# Altium project Nabaztag_RPI_V2.0.PrjPcb
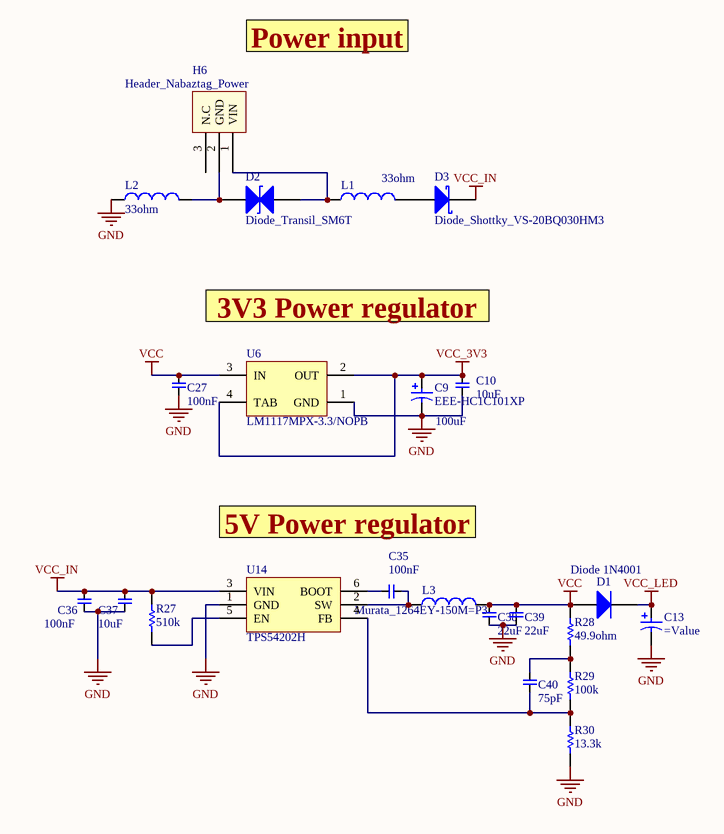
[diagram p0: PyNab_Power.SchDoc]
4 sheets, 151 parts. Net scope: flat (ports and power ports of the same name join across sheets).
Board file: Nabaztag_RPI_V2.0.PcbDoc
Sheets:
  PyNab_Power.SchDoc
  PyNab_Header_LED_RFID.SchDoc
  PyNab_Audio.SchDoc
  PyNab_Motor&Encoders.SchDoc

## Sheet PyNab_Power.SchDoc: PyNab - Power
size A4; CompanyName: Enero; DrawnBy: Enero; Engineer: Hugo Balette-pape; Organization: ENERO; Address1: 7, rue ambroise thomas; Address2: 75009; Address3: Paris; Address4: France; Revision: 2.0; SheetNumber: 1; SheetTotal: 4

### Parts
C9  EEE-HC1C101XP  value 100uF  [EEE-HC1C101XP]
C10  10uF  [CAP0603]
C13  (no value)  [CAPAE6083X105M]
C27  100nF  [CAP0603]
C35  100nF  [CAP0603]
C36  100nF  [CAP0603]
C37  10uF  [CAP0603]
C38  22uF  [CAP0603]
C39  22uF  [CAP0603]
C40  75pF  [CAP0603]
D1  Diode 1N4001  [DO-41]
D2  Diode_Transil_SM6T  [Diode_Transil_SM6T]
D3  Diode_Shottky_VS-20BQ030HM3  [Diode_Shottky_VS-20BQ030HM3]
H6  Header_Nabaztag_Power  [HDR3x1_Nabaztag_pwr]
L1  33ohm  [IND0603]
L2  33ohm  [IND0603]
L3  Murata_1264EY-150M=P3  [Murata-1264EY-150M=P3]
R27  510k  [RES0603]
R28  49.9ohm  [RES0603]
R29  100k  [RES0603]
R30  13.3k  [RES0603]
U6  LM1117MPX-3.3/NOPB  [MP04A_N]
U14  TPS54202H  [SOT95P280X110-6N]

### Nets
GND: C9.1(K) C10.1 C13.2(K) C27.1 C36.1 C37.1 C38.1 C39.1 L2.2 R30.1 U6.1(GND) U14.1(GND)
VCC: C27.2 C38.2 C39.2 D1.1(A) L3.2 R28.2 U6.3(IN)
VCC_3V3: C9.2(A) C10.2 U6.2(OUT) U6.4(TAB)
VCC_IN: C36.2 C37.2 D3.1(K) R27.1 U14.3(VIN)
VCC_LED: C13.1(A) D1.2(K)
NetC35_1: C35.1 L3.1 U14.2(SW)
NetC35_2: C35.2 U14.6(BOOT)
NetC40_1: C40.1 R28.1 R29.2
NetC40_2: C40.2 R29.1 R30.2 U14.4(FB)
NetD2_1: D2.1 H6.2(GND) L2.1
NetD2_2: D2.2 H6.1(VIN) L1.2
NetD3_2: D3.2(A) L1.1
NetR27_2: R27.2 U14.5(EN)

Not connected (* = marked no-connect by the designer): H6 3(N.C)

### Notes on the sheet
- Power input
- 3V3 Power regulator
- 5V Power regulator
- Title
- Size:
- Date:
- A4
- Number:
- Time:
- Revision:
- Sheet
- of
- File:

### Library data of the parts
C9 = VS0608 pol cap electro SMT
C10 C27 C35-C40 = Capacitor_np: Non-polarised capacitor
  C10 C37: Value: 10uF
  C27 C35 C36: Value: 100nF
  C38 C39: Value: 22uF
  C40: Value: 75pF
C13 = Capacitor_pol: Polarised capacitor
D1 = Diode 1N4001: 1 Amp General Purpose Rectifier; Published: 8-Jun-2000; LatestRevisionDate: 17-Jul-2002; LatestRevisionNote: Re-released for DXP Platform.; DatasheetVersion: 1998; PackageVersion: Aug-1999; PackageReference: DO-41; Publisher: Altium Limited; PackageDescription: Diode, Axial; Body 5.2 x 2.7 mm (LxDia. max), Lead Dia. 0.86 mm (max); Code_JEDEC: DO-204-AL; ComponentLink1Description: Manufacturer Link; ComponentLink1URL: http://www.fairchildsemi.com/; ComponentLink2Description: Datasheet; ComponentLink2URL: http://www.fairchildsemi.com/ds/1N%2F1N4001.pdf
H6 = Header_Nabaztag_Power: Power Header
L1 L2 = Inductor1: Inductor 0603 blm18pg330sn; Value: 33ohm
L3 = Inductor1: Inductor; Value: =Value
R27-R30 = Resistor1: Resistor
  R27: Value: 510k
  R28: Value: 49.9ohm
  R29: Value: 100k
  R30: Value: 13.3k
U6 = LM1117MPX-3.3/NOPB: 800mA Low-Dropout Linear Regulator, 4-pin SOT-223, Pb-Free; Manufacturer: National Semiconductor; PackageTopMarking: XYTT*N05A; PowerWise: N; CompType: LDO IC; High-Reliability: Y; DatasheetVersion: Apr-2006; PackageVersion: revB, Apr-2003; PackageReference: MP04A; PackageDescription: Molded SOT-223, 6.50 x 3.56 x 1.6mm Body, 4 Lead, 2.3mm Pitch; PartNumber: LM1117MPX-3.3/NOPB; RoHS: Y; PinCount: 4; Code_JEDEC: TO-261-AA; Code_IPC: SOT223-4; ComponentLink1Description: Manufacturer URL; ComponentLink1URL: http://www.national.com/; ComponentLink2Description: LM1117 Datasheet; ComponentLink2URL: http://www.national.com/ds/LM/LM1117.pdf; ComponentLink3Description: LM1117 Web Page; ComponentLink3URL: http://www.national.com/pf/LM/LM1117.html; ComponentLink4Description: MP04A Package Page; ComponentLink4URL: http://www.national.com/packaging/folders/mp04a.html

## Sheet PyNab_Header_LED_RFID.SchDoc: PyNab - Headers / Leds / Sensors
size A3; CompanyName: Enero; DrawnBy: Enero; Engineer: Hugo Balette-pape; Organization: ENERO; Address1: 7, rue ambroise thomas; Address2: 75009; Address3: Paris; Address4: France; Revision: 2.0; SheetNumber: 2; SheetTotal: 4
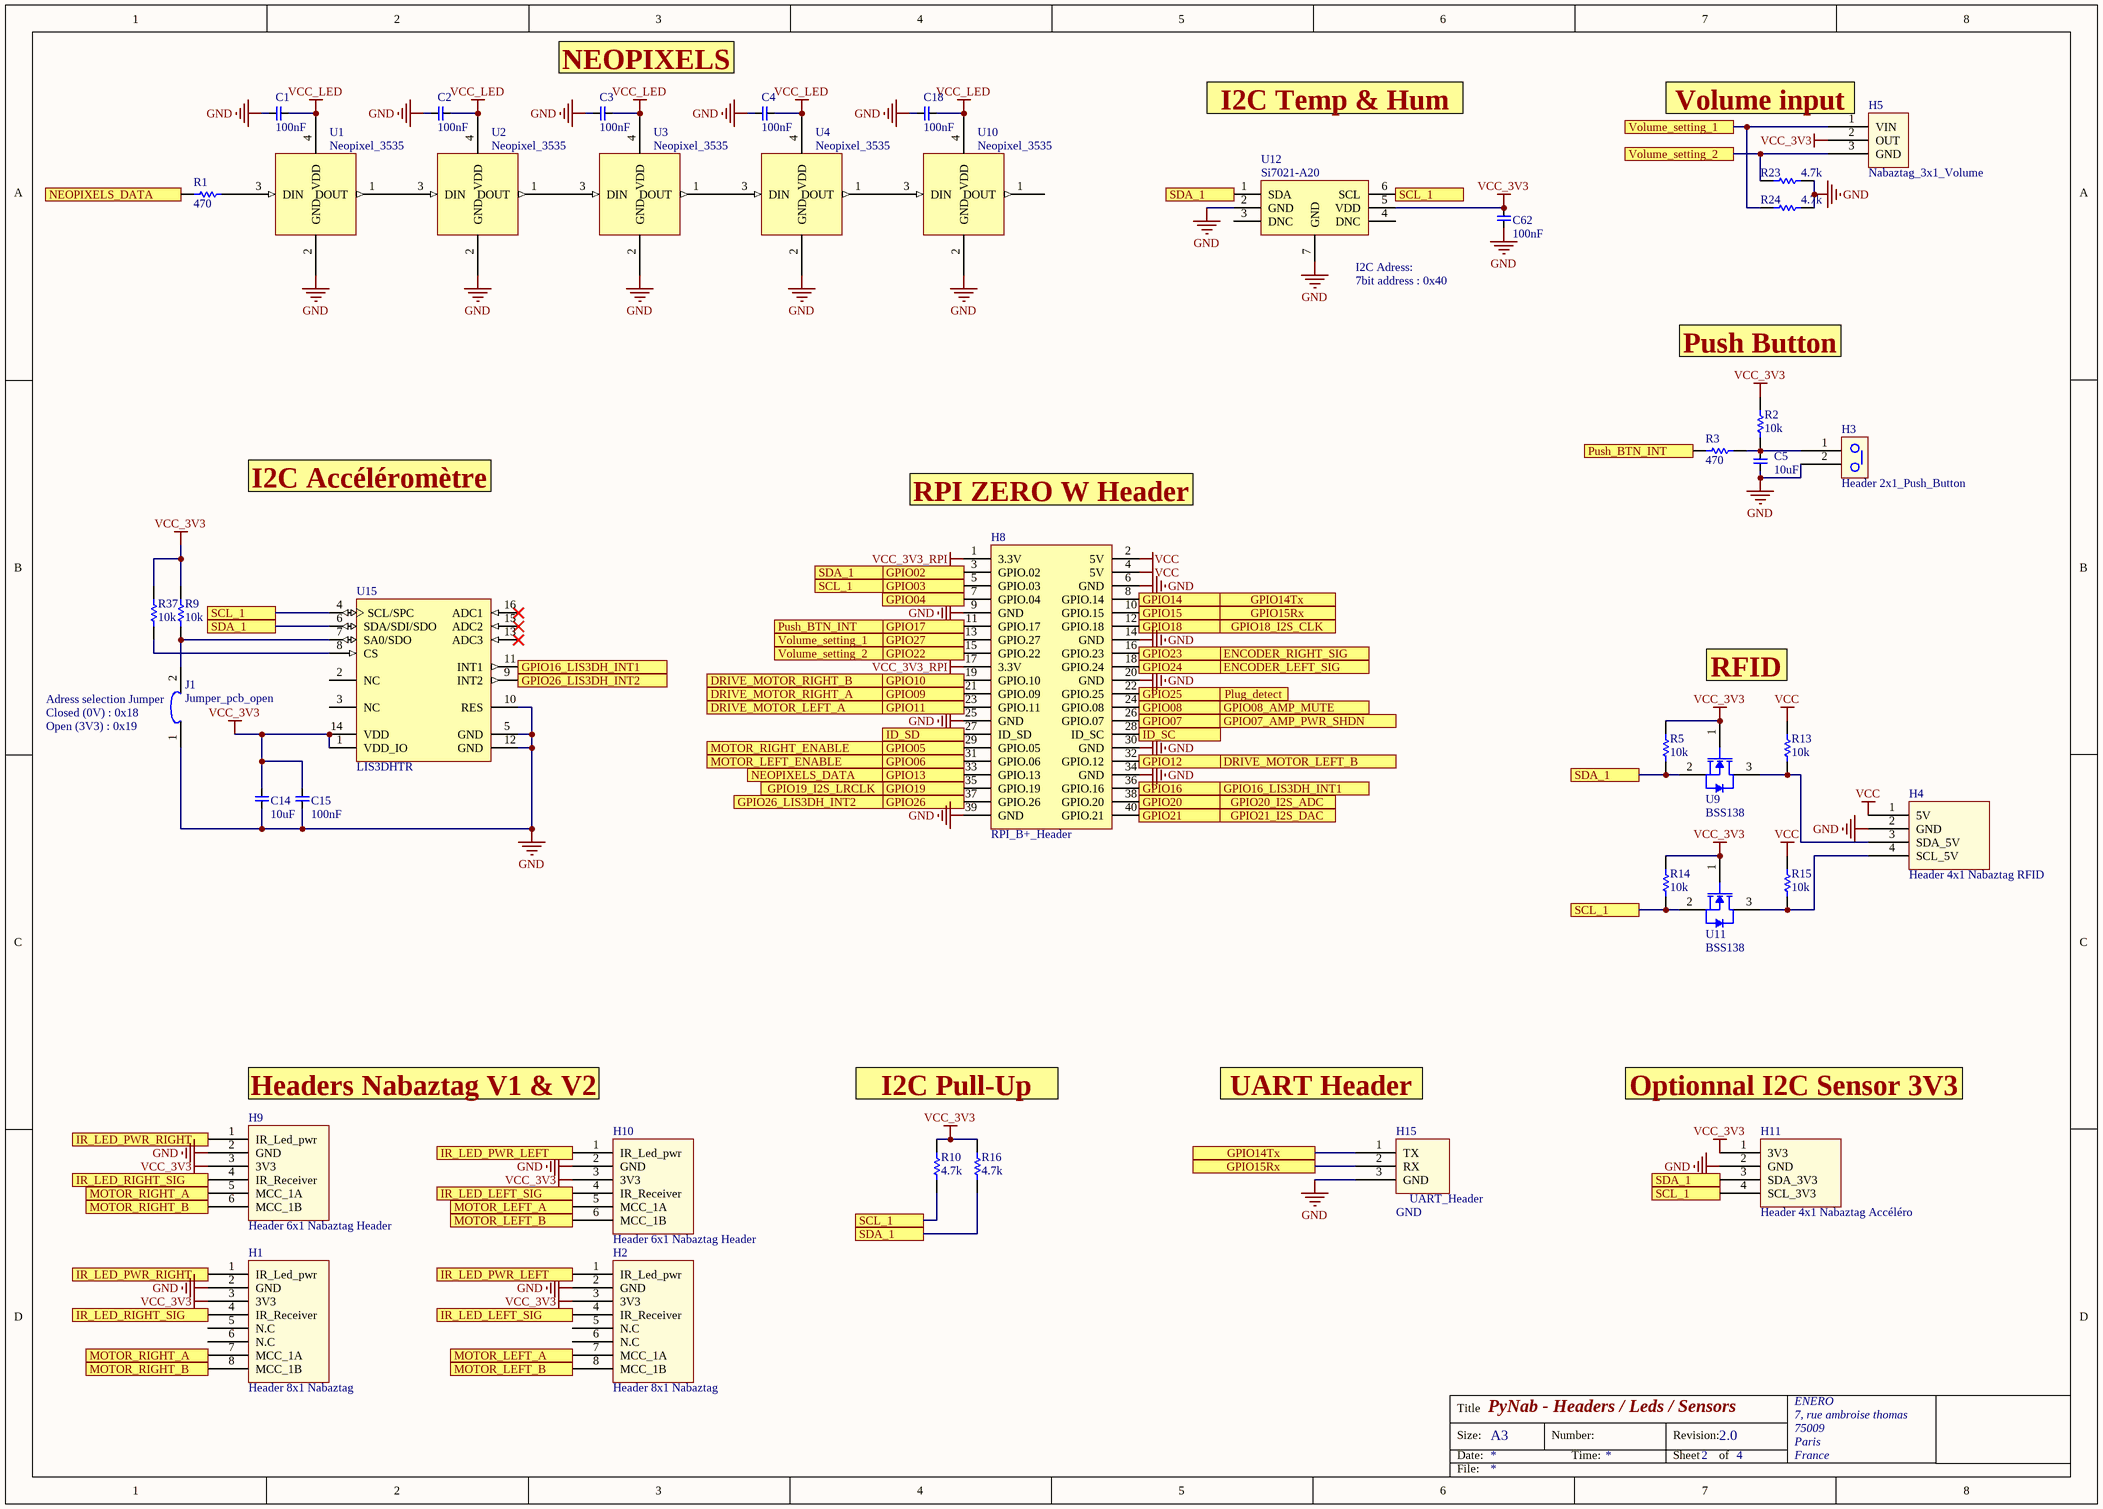
[diagram p1: PyNab_Header_LED_RFID.SchDoc]

### Parts
C1  100nF  [CAP0603]
C2  100nF  [CAP0603]
C3  100nF  [CAP0603]
C4  100nF  [CAP0603]
C5  10uF  [CAP0603]
C14  10uF  [CAP0603]
C15  100nF  [CAP0603]
C18  100nF  [CAP0603]
C62  100nF  [CAP0603]
H1  Header 8x1 Nabaztag  [HDR8x1 NABAZTAG -RIGHT]
H2  Header 8x1 Nabaztag  [HDR8x1 NABAZTAG]
H3  Header 2x1_Push_Button  [HDR2x1_Push_button]
H4  Header 4x1 Nabaztag RFID  [NABAZTAG_RFID_HEADER]
H5  Nabaztag_3x1_Volume  [Nabaztag_Volume_Header]
H8  RPI_B+_Header  [RPI_B+_40Pin_Header]
H9  Header 6x1 Nabaztag Header  [HDR6x1_Nabaztag]
H10  Header 6x1 Nabaztag Header  [HDR6x1_Nabaztag]
H11  Header 4x1 Nabaztag Accéléro  [NABAZTAG_ACCELERO_HEADER 3V3]
H15  GND  [Header_UART_3x1]
J1  Jumper_pcb_open  [Jumper_pcb open 2]
R1  470  [RES0603]
R2  10k  [RES0603]
R3  470  [RES0603]
R5  10k  [RES0603]
R9  10k  [RES0603]
R10  4.7k  [RES0603]
R13  10k  [RES0603]
R14  10k  [RES0603]
R15  10k  [RES0603]
R16  4.7k  [RES0603]
R23  4.7k  [RES0603]
R24  4.7k  [RES0603]
R37  10k  [RES0603]
U1  Neopixel_3535  [NEOPIXEL_35x35]
U2  Neopixel_3535  [NEOPIXEL_35x35]
U3  Neopixel_3535  [NEOPIXEL_35x35]
U4  Neopixel_3535  [NEOPIXEL_35x35]
U9  BSS138  [BSS138]
U10  Neopixel_3535  [NEOPIXEL_35x35]
U11  BSS138  [BSS138]
U12  Si7021-A20  [SON100P300X121_HS-7N]
U15  LIS3DHTR  [STM-LGA-16]

### Ports
DRIVE_MOTOR_LEFT_A, DRIVE_MOTOR_LEFT_B, DRIVE_MOTOR_RIGHT_A, DRIVE_MOTOR_RIGHT_B, ENCODER_LEFT_SIG, ENCODER_RIGHT_SIG, GPIO02, GPIO03, GPIO04, GPIO05, GPIO06, GPIO07, GPIO07_AMP_PWR_SHDN, GPIO08, GPIO08_AMP_MUTE, GPIO09, GPIO10, GPIO11, GPIO12, GPIO13, GPIO14, GPIO14Tx, GPIO15, GPIO15Rx, GPIO16, GPIO16_LIS3DH_INT1, GPIO17, GPIO18, GPIO18_I2S_CLK, GPIO19, GPIO19_I2S_LRCLK, GPIO20, GPIO20_I2S_ADC, GPIO21, GPIO21_I2S_DAC, GPIO22, GPIO23, GPIO24, GPIO25, GPIO26, GPIO26_LIS3DH_INT2, GPIO27, ID_SC, ID_SD, IR_LED_LEFT_SIG, IR_LED_PWR_LEFT, IR_LED_PWR_RIGHT, IR_LED_RIGHT_SIG, MOTOR_LEFT_A, MOTOR_LEFT_B, MOTOR_LEFT_ENABLE, MOTOR_RIGHT_A, MOTOR_RIGHT_B, MOTOR_RIGHT_ENABLE, NEOPIXELS_DATA, Plug_detect, Push_BTN_INT, SCL_1, SDA_1, Volume_setting_1, Volume_setting_2

### Nets
GND: C1.1 C2.1 C3.1 C4.1 C5.1 C14.2 C15.2 C18.1 C62.1 H1.2(GND) H2.2(GND) H3.2 H4.2(GND) H8.6(GND) H8.9(GND) H8.14(GND) H8.20(GND) H8.25(GND) H8.30(GND) H8.34(GND) H8.39(GND) H9.2(GND) H10.2(GND) H11.2(GND) H15.3(GND) J1.1 R23.1 R24.1 U1.2(GND) U2.2(GND) U3.2(GND) U4.2(GND) U10.2(GND) U12.2(GND) U12.7(GND) U15.5(GND) U15.10(RES) U15.12(GND)
VCC: H4.1(5V) H8.2(5V) H8.4(5V) R13.2 R15.2
VCC_3V3: C14.1 C15.1 C62.2 H1.3(3V3) H2.3(3V3) H5.2(OUT) H9.3(3V3) H10.3(3V3) H11.1(3V3) R2.2 R5.2 R9.1 R10.2 R14.2 R16.2 R37.1 U9.1(G) U11.1(G) U12.5(VDD) U15.1(VDD_IO) U15.14(VDD)
VCC_3V3_RPI: H8.1(3.3V) H8.17(3.3V)
VCC_LED: C1.2 C2.2 C3.2 C4.2 C18.2 U1.4(VDD) U2.4(VDD) U3.4(VDD) U4.4(VDD) U10.4(VDD)
NetC5_2: C5.2 H3.1 R2.1 R3.2
NetC12_2: H1.4(IR_Receiver) H9.4(IR_Receiver) ; port IR_LED_RIGHT_SIG
NetC16_2: H2.4(IR_Receiver) H10.4(IR_Receiver) ; port IR_LED_LEFT_SIG
NetC23_2: H8.22(GPIO.25) ; port GPIO25, port Plug_detect
NetH1_1: H1.1(IR_Led_pwr) H9.1(IR_Led_pwr) ; port IR_LED_PWR_RIGHT
NetH1_7: H1.7(MCC_1A) H9.5(MCC_1A) ; port MOTOR_RIGHT_A
NetH1_8: H1.8(MCC_1B) H9.6(MCC_1B) ; port MOTOR_RIGHT_B
NetH2_1: H2.1(IR_Led_pwr) H10.1(IR_Led_pwr) ; port IR_LED_PWR_LEFT
NetH2_7: H2.7(MCC_1A) H10.5(MCC_1A) ; port MOTOR_LEFT_A
NetH2_8: H2.8(MCC_1B) H10.6(MCC_1B) ; port MOTOR_LEFT_B
NetH4_3: H4.3(SDA_5V) R13.1 U9.3(D)
NetH4_4: H4.4(SCL_5V) R15.1 U11.3(D)
NetH5_1: H5.1(VIN) H8.13(GPIO.27) R24.2 ; port GPIO27, port Volume_setting_1
NetH5_3: H5.3(GND) H8.15(GPIO.22) R23.2 ; port GPIO22, port Volume_setting_2
NetH8_3: H8.3(GPIO.02) H11.3(SDA_3V3) R5.1 R16.1 U9.2(S) U12.1(SDA) U15.6(SDA/SDI/SDO) ; port GPIO02, port SDA_1
NetH8_5: H8.5(GPIO.03) H11.4(SCL_3V3) R10.1 R14.1 U11.2(S) U12.6(SCL) U15.4(SCL/SPC) ; port GPIO03, port SCL_1
NetH8_7: H8.7(GPIO.04) ; port GPIO04
NetH8_8: H8.8(GPIO.14) H15.1(TX) ; port GPIO14, port GPIO14Tx
NetH8_10: H8.10(GPIO.15) H15.2(RX) ; port GPIO15, port GPIO15Rx
NetH8_11: H8.11(GPIO.17) R3.1 ; port GPIO17, port Push_BTN_INT
NetH8_12: H8.12(GPIO.18) ; port GPIO18, port GPIO18_I2S_CLK
NetH8_16: H8.16(GPIO.23) ; port ENCODER_RIGHT_SIG, port GPIO23
NetH8_18: H8.18(GPIO.24) ; port ENCODER_LEFT_SIG, port GPIO24
NetH8_19: H8.19(GPIO.10) ; port DRIVE_MOTOR_RIGHT_B, port GPIO10
NetH8_21: H8.21(GPIO.09) ; port DRIVE_MOTOR_RIGHT_A, port GPIO09
NetH8_23: H8.23(GPIO.11) ; port DRIVE_MOTOR_LEFT_A, port GPIO11
NetH8_24: H8.24(GPIO.08) ; port GPIO08, port GPIO08_AMP_MUTE
NetH8_26: H8.26(GPIO.07) ; port GPIO07, port GPIO07_AMP_PWR_SHDN
NetH8_27: H8.27(ID_SD) ; port ID_SD
NetH8_28: H8.28(ID_SC) ; port ID_SC
NetH8_29: H8.29(GPIO.05) ; port MOTOR_RIGHT_ENABLE, port GPIO05
NetH8_31: H8.31(GPIO.06) ; port MOTOR_LEFT_ENABLE, port GPIO06
NetH8_32: H8.32(GPIO.12) ; port DRIVE_MOTOR_LEFT_B, port GPIO12
NetH8_33: H8.33(GPIO.13) R1.1 ; port NEOPIXELS_DATA, port GPIO13
NetH8_35: H8.35(GPIO.19) ; port GPIO19, port GPIO19_I2S_LRCLK
NetH8_36: H8.36(GPIO.16) U15.11(INT1) ; port GPIO16, port GPIO16_LIS3DH_INT1
NetH8_37: H8.37(GPIO.26) U15.9(INT2) ; port GPIO26, port GPIO26_LIS3DH_INT2
NetH8_38: H8.38(GPIO.20) ; port GPIO20, port GPIO20_I2S_ADC
NetH8_40: H8.40(GPIO.21) ; port GPIO21, port GPIO21_I2S_DAC
NetJ1_2: J1.2 R9.2 U15.7(SA0/SDO)
NetR1_2: R1.2 U1.3(DIN)
NetR37_2: R37.2 U15.8(CS)
NetU1_1: U1.1(DOUT) U2.3(DIN)
NetU2_1: U2.1(DOUT) U3.3(DIN)
NetU3_1: U3.1(DOUT) U4.3(DIN)
NetU4_1: U4.1(DOUT) U10.3(DIN)

Not connected (* = marked no-connect by the designer): H1 5(N.C) 6(N.C); H2 5(N.C) 6(N.C); U10 1(DOUT); U12 3(DNC) 4(DNC); U15 2(NC) 3(NC) 13(ADC3)* 15(ADC2)* 16(ADC1)*

### Notes on the sheet
- NEOPIXELS
- I2C Temp & Hum
- (near H5) Volume input
- (near U12) I2C Adress:
- 7bit address : 0x40
- Push Button
- I2C Accéléromètre
- RPI ZERO W Header
- (near J1) Adress selection Jumper
- (near J1) Closed (0V) : 0x18
- RFID
- (near J1) Open (3V3) : 0x19
- Headers Nabaztag V1 & V2
- I2C Pull-Up
- UART Header
- Optionnal I2C Sensor 3V3
- Title
- Size:
- Date:
- A3
- Number:
- Time:
- Revision:
- Sheet
- of
- File:
- (in symbol GND) UART_Header

### Library data of the parts
C1-C5 C14 C15 C18 C62 = Capacitor_np: Non-polarised capacitor
  C1-C4 C15 C18 C62: Value: 100nF
  C5 C14: Value: 10uF
H3 = Header 2x1_Push_Button: Push_Button header
H8 = RPI_B+_40Pin_Header
R1-R3 R5 R9 R10 R13-R16 R23 R24 R37 = Resistor1: Resistor
  R1 R3: Value: 470
  R2 R5 R9 R13-R15 R37: Value: 10k
  R10 R16 R23 R24: Value: 4.7k
U15 = CMP-0234-00055-4: Manufacturer: STMicroelectronics; Interface: I2C, SPI; Packing: Tape and Reel; Wide Supply Voltage: 1.71 to 3.6 V; Output Type: Digital; Bandwidth: 5 kHz; Current Consumption in Power-Down mode: 0.5 uA; ComponentLink2Description: Datasheet; ComponentLink3URL: http://www.st.com/st-web-ui/static/active/en/resource/technical/document/datasheet/CD00274221.pdf; Mounting Technology: Surface Mount; PackageReference: LGA-16; PackageDescription: 16-Pin Land Grid Array, Body 3 x 3 mm, Pitch 0.5 mm; ComponentLink3Description: Package Specification; DatasheetVersion: Rev. 1; Operating Temperature: -40 to 85 degC; PartNumber: LIS3DHTR; ComponentLink1Description: Manufacturer URL; ComponentLink1URL: http://www.st.com/; ComponentLink2URL: http://www.st.com/st-web-ui/static/active/en/resource/technical/document/datasheet/CD00274221.pdf; RoHS: TRUE

## Sheet PyNab_Audio.SchDoc: PyNab - Audio
size A4; CompanyName: Enero; DrawnBy: Enero; Engineer: Hugo Balette-pape; Organization: ENERO; Address1: 7, rue ambroise thomas; Address2: 75009; Address3: Paris; Address4: France; Revision: 2.0; SheetNumber: 3; SheetTotal: 4
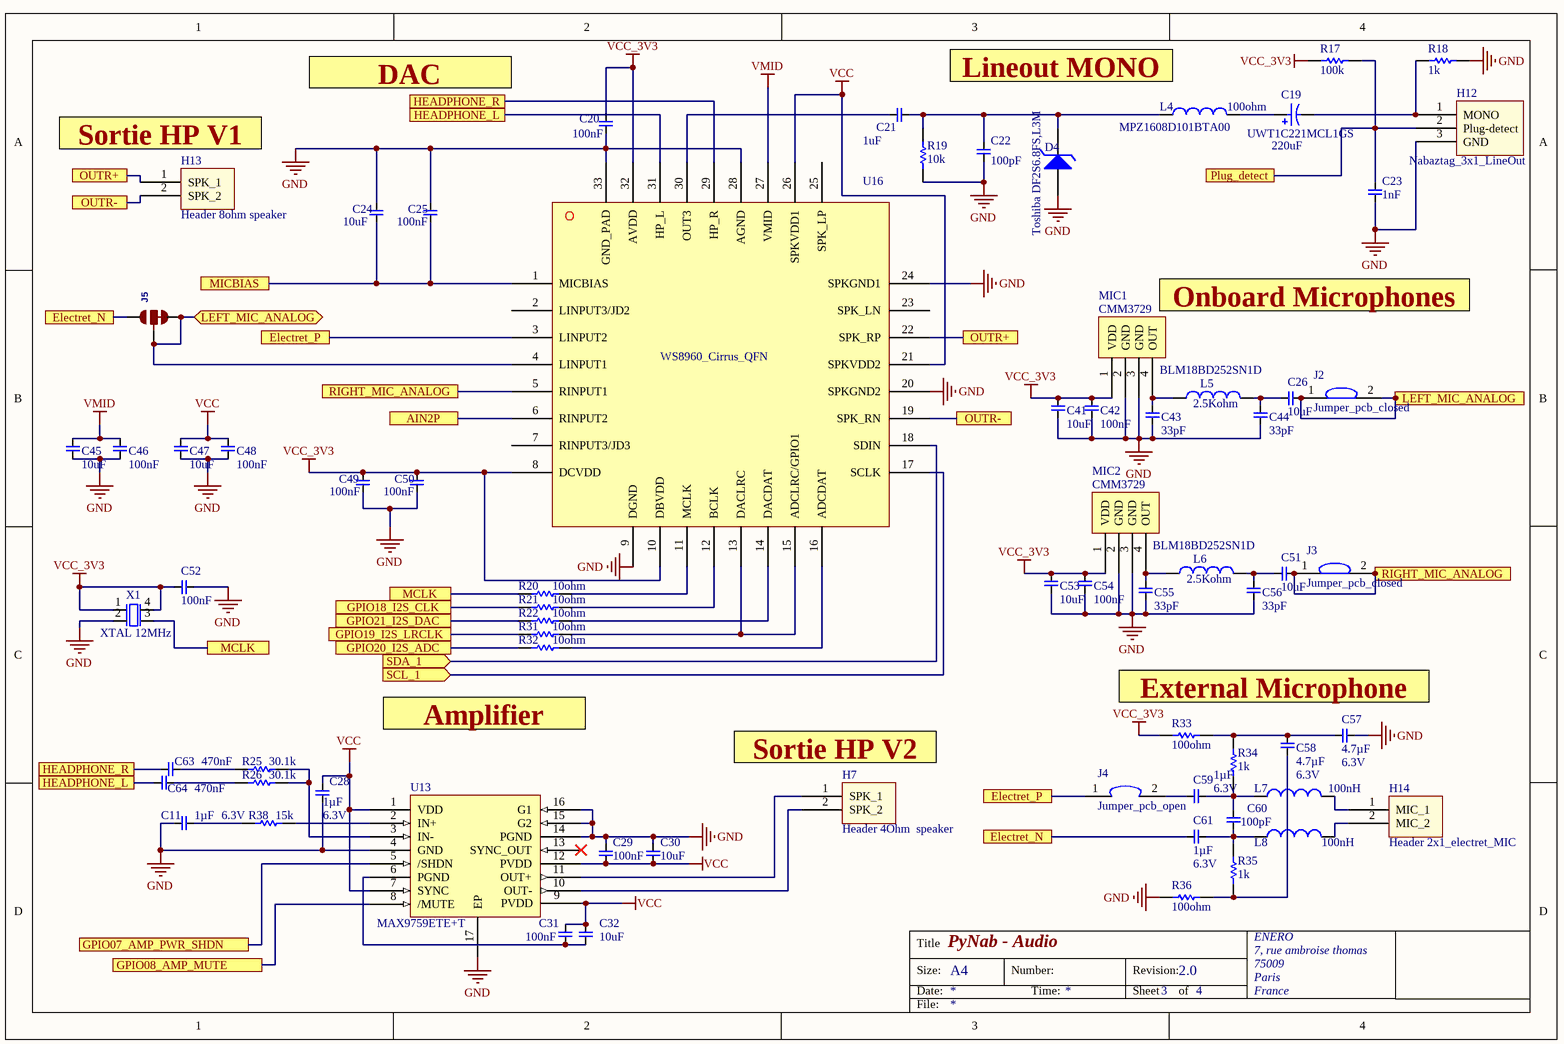
[diagram p2: PyNab_Audio.SchDoc]

### Parts
C11  Voltage: 6.3V  [CAP0603]  (hidden comment: 1µF)
C19  UWT1C221MCL1GS  value 220uF  [CAPAE7066X80M]
C20  100nF  [CAP0603]
C21  1uF  [CAP0603]
C22  100pF  [CAP0603]
C23  1nF  [CAP0603]
C24  10uF  [CAP0603]
C25  100nF  [CAP0603]
C26  10uF  [CAP0603]
C28  Voltage: 6.3V  [CAP0603]  (hidden comment: 1µF)
C29  100nF  [CAP0603]
C30  10uF  [CAP0603]
C31  100nF  [CAP0603]
C32  10uF  [CAP0603]
C41  10uF  [CAP0603]
C42  100nF  [CAP0603]
C43  33pF  [CAP0603]
C44  33pF  [CAP0603]
C45  10uF  [CAP0603]
C46  100nF  [CAP0603]
C47  10uF  [CAP0603]
C48  100nF  [CAP0603]
C49  100nF  [CAP0603]
C50  100nF  [CAP0603]
C51  10uF  [CAP0603]
C52  100nF  [CAP0603]
C53  10uF  [CAP0603]
C54  100nF  [CAP0603]
C55  33pF  [CAP0603]
C56  33pF  [CAP0603]
C57  Voltage: 6.3V  [CAP0603]  (hidden comment: 4.7µF)
C58  Voltage: 6.3V  [CAP0603]  (hidden comment: 4.7µF)
C59  Voltage: 6.3V  [CAP0603]  (hidden comment: 1µF)
C60  100pF  [CAP0603]
C61  Voltage: 6.3V  [CAP0603]  (hidden comment: 1µF)
C63  470nF  [CAP0603]
C64  470nF  [CAP0603]
D4  Toshiba DF2S6.8FS,L3M  [Diode SOD-923 DF2S6.8FS]
H7  Header 4Ohm  speaker  [HRD2x1_SPEAKER_Nabaztag]
H12  Nabaztag_3x1_LineOut  [Nabaztag_LineOut]
H13  Header 8ohm speaker  [HRD2x1_SPEAKER_Nabaztag]
H14  Header 2x1_electret_MIC  [HRD2x1_MIC_Nabaztag]
J2  Jumper_pcb_closed  [Jumper_pcb_closed 2]
J3  Jumper_pcb_closed  [Jumper_pcb_closed 2]
J4  Jumper_pcb_open  [Jumper_pcb open 2]
J5  Normally closed trace jumper (1 of 2 connections)This jumper has a trace between two pads so it's normally closed (NC). The other connection is normally open (NO). Use a razor knife to open the connection. For best results follow the IPC guidelines for cutting traces:Reapply solder to reclose the connection, or to close the NO connection.  [Jumper_pcb_3poles]  (value not drawn)
L4  MPZ1608D101BTA00  value 100ohm  [IND0603]
L5  BLM18BD252SN1D  value 2.5Kohm  [IND0603]
L6  BLM18BD252SN1D  value 2.5Kohm  [IND0603]
L7  value 100nH  [IND0603]  (hidden comment: MLZ1608DR10DT)
L8  value 100nH  [IND0603]  (hidden comment: MLZ1608DR10DT)
MIC1  CMM3729  [DFN246P295X110-4N]
MIC2  CMM3729  [DFN246P295X110-4N]
R17  100k  [RES0603]
R18  1k  [RES0603]
R19  10k  [RES0603]
R20  10ohm  [RES0603]
R21  10ohm  [RES0603]
R22  10ohm  [RES0603]
R25  30.1k  [RES0603]
R26  30.1k  [RES0603]
R31  10ohm  [RES0603]
R32  10ohm  [RES0603]
R33  100ohm  [RES0603]
R34  1k  [RES0603]
R35  1k  [RES0603]
R36  100ohm  [RES0603]
R38  15k  [RES0603]
U13  MAX9759ETE+T  [MAX9759ETE+T]
U16  WS8960_Cirrus_QFN  [QFN50P500X500X100_HS-33N]
X1  XTAL 12MHz  [XTAL_2025_4Pin ECS-2520S33-120-FN-TR]

### Ports
AIN2P, Electret_N, Electret_P, GPIO07_AMP_PWR_SHDN, GPIO08_AMP_MUTE, GPIO18_I2S_CLK, GPIO19_I2S_LRCLK, GPIO20_I2S_ADC, GPIO21_I2S_DAC, HEADPHONE_L, HEADPHONE_R, LEFT_MIC_ANALOG, LEFT_MIC_ANALOG (bidir), MCLK, MICBIAS, OUTR+, OUTR-, Plug_detect, RIGHT_MIC_ANALOG, SCL_1 (in), SDA_1 (in)

### Nets
GND: C11.2 C20.1 C22.1 C23.1 C24.2 C25.2 C28.2 C29.2 C30.1 C41.2 C42.1 C43.1 C44.1 C45.2 C46.1 C47.2 C48.1 C49.1 C50.1 C52.1 C53.2 C54.1 C55.1 C56.1 C57.2 D4.2(A) H12.3(GND) MIC1.2(GND) MIC1.3(GND) MIC2.2(GND) MIC2.3(GND) R18.1 R19.1 R36.2 U13.4(GND) U13.14(PGND) U13.15(G2) U13.16(G1) U13.17(EP) U16.9(DGND) U16.20(SPKGND2) U16.24(SPKGND1) U16.28(AGND) U16.33(GND_PAD) X1.2(GND)
VCC: C28.1 C29.1 C30.2 C31.2 C32.1 C47.1 C48.2 U13.1(VDD) U13.7(SYNC) U13.9(PVDD) U13.12(PVDD) U16.21(SPKVDD2) U16.26(SPKVDD1)
VCC_3V3: C20.2 C41.1 C42.2 C49.2 C50.2 C52.2 C53.1 C54.2 MIC1.1(VDD) MIC2.1(VDD) R17.2 R33.2 U16.8(DCVDD) U16.10(DBVDD) U16.32(AVDD) X1.1(EN) X1.4(VDD)
VMID: C45.1 C46.2 U16.27(VMID)
NetC11_1: C11.1 R38.2
NetC19_1: C19.1(K) H12.1(MONO) R18.2
NetC19_2: C19.2(A) L4.1
NetC21_1: C21.1 U16.30(OUT3)
NetC21_2: C21.2 C22.2 D4.1(K) L4.2 R19.2
NetC23_2: C23.2 H12.2(Plug-detect) R17.1 ; port Plug_detect
NetC24_1: C24.1 C25.1 U16.1(MICBIAS) ; port MICBIAS
NetC26_1: C26.1 C44.2 L5.1
NetC26_2: C26.2 J2.1 J2.2 J5.2 J5.3 U16.4(LINPUT1) ; port LEFT_MIC_ANALOG
NetC31_1: C31.1 C32.2 U13.6(PGND)
NetC43_2: C43.2 L5.2 MIC1.4(OUT)
NetC51_1: C51.1 C56.2 L6.1
NetC51_2: C51.2 J3.1 J3.2 U16.5(RINPUT1) ; port RIGHT_MIC_ANALOG
NetC55_2: C55.2 L6.2 MIC2.4(OUT)
NetC57_1: C57.1 C58.1 R33.1 R34.2
NetC58_2: C58.2 R35.1 R36.1
NetC59_1: C59.1 C60.1 L7.2 R34.1
NetC59_2: C59.2 J4.2
NetC60_2: C60.2 C61.1 L8.2 R35.2
NetC61_2: C61.2 J5.1 ; port Electret_N
NetC63_1: C63.1 R25.2
NetC63_2: C63.2 U16.29(HP_R) ; port HEADPHONE_R
NetC64_1: C64.1 R26.2
NetC64_2: C64.2 U16.31(HP_L) ; port HEADPHONE_L
NetH7_1: H7.1(SPK_1) U13.11(OUT+)
NetH7_2: H7.2(SPK_2) U13.10(OUT-)
NetH8_3: U16.18(SDIN) ; port SDA_1
NetH8_5: U16.17(SCLK) ; port SCL_1
NetH8_12: R21.2 ; port GPIO18_I2S_CLK
NetH8_24: U13.8(/MUTE) ; port GPIO08_AMP_MUTE
NetH8_26: U13.5(/SHDN) ; port GPIO07_AMP_PWR_SHDN
NetH8_35: R31.2 ; port GPIO19_I2S_LRCLK
NetH8_38: R32.2 ; port GPIO20_I2S_ADC
NetH8_40: R22.2 ; port GPIO21_I2S_DAC
NetH13_1: H13.1(SPK_1) U16.22(SPK_RP) ; port OUTR+
NetH13_2: H13.2(SPK_2) U16.19(SPK_RN) ; port OUTR-
NetH14_1: H14.1(MIC_1) L7.1
NetH14_2: H14.2(MIC_2) L8.1
NetJ4_1: J4.1 U16.3(LINPUT2) ; port Electret_P
NetR20_1: R20.1 U16.11(MCLK)
NetR20_2: R20.2 X1.3(OUT) ; port MCLK
NetR21_1: R21.1 U16.12(BCLK)
NetR22_1: R22.1 U16.14(DACDAT)
NetR25_1: R25.1 R26.1 U13.3(IN-)
NetR31_1: R31.1 U16.13(DACLRC) U16.15(ADCLRC/GPIO1)
NetR32_1: R32.1 U16.16(ADCDAT)
NetR38_1: R38.1 U13.2(IN+)
NetU16_6: U16.6(RINPUT2) ; port AIN2P

Not connected (* = marked no-connect by the designer): U13 13(SYNC_OUT)*; U16 2(LINPUT3/JD2) 7(RINPUT3/JD3) 23(SPK_LN) 25(SPK_LP)

### Notes on the sheet
- DAC
- (near L4) Lineout MONO
- (near H13) Sortie HP V1
- (near MIC1) Onboard Microphones
- Amplifier
- External Microphone
- (near H7) Sortie HP V2
- Title
- Size:
- Date:
- A4
- Number:
- Time:
- Revision:
- Sheet
- of
- File:

### Library data of the parts
C11 C20-C26 C28-C32 C41-C59 C61 C63 C64 = Capacitor_np: Non-polarised capacitor
  C11 C28 C59 C61: Value: 1µF
  C20 C25 C29 C31 C42 C46 C48-C50 C52 C54: Value: 100nF
  C21: Value: 1uF
  C22: Value: 100pF
  C23: Value: 1nF
  C24 C26 C30 C32 C41 C45 C47 C51 C53: Value: 10uF
  C43 C44 C55 C56: Value: 33pF
  C57 C58: Value: 4.7µF
  C63 C64: Value: 470nF
C19 = Capacitor_pol: Polarised capacitor
C60 = Capacitor_np: Non-polarised capacitor; Voltage: 6.3V; Value: 100pF
D4 = Diode ESD DF2S6.8FS
H7 H13 = Header 2x1_speaker
J5 = JUMPER-SMT_3_1-NC_TRACE_SILK: GateName_1: G$1; SymbolName_1: SMT-JUMPER_3_1-NC_TRACE; DeviceName: _SILK; LibraryName: Sparkfun_jumper; DeviceSetName: JUMPER-SMT_3_1-NC_TRACE; Package: SMT-JUMPER_3_1-NC_TRACE_SILK
L4-L6 = Inductor1: Inductor 0603 blm18pg330sn
L7 L8 = Inductor1: Inductor 0603 MLZ1608DR10DT
R17-R22 R25 R26 R31-R36 R38 = Resistor1: Resistor
  R17: Value: 100k
  R18 R34 R35: Value: 1k
  R19: Value: 10k
  R20-R22 R31 R32: Value: 10ohm
  R25 R26: Value: 30.1k
  R33 R36: Value: 100ohm
  R38: Value: 15k
X1 = XTAL_2025_4pin

## Sheet PyNab_Motor&Encoders.SchDoc: PyNab - Motor & Ear Encoders
size A4; CompanyName: Enero; DrawnBy: Enero; Engineer: Hugo Balette-pape; Organization: ENERO; Address1: 7, rue ambroise thomas; Address2: 75009; Address3: Paris; Address4: France; Revision: 2.0; SheetNumber: 4; SheetTotal: 4
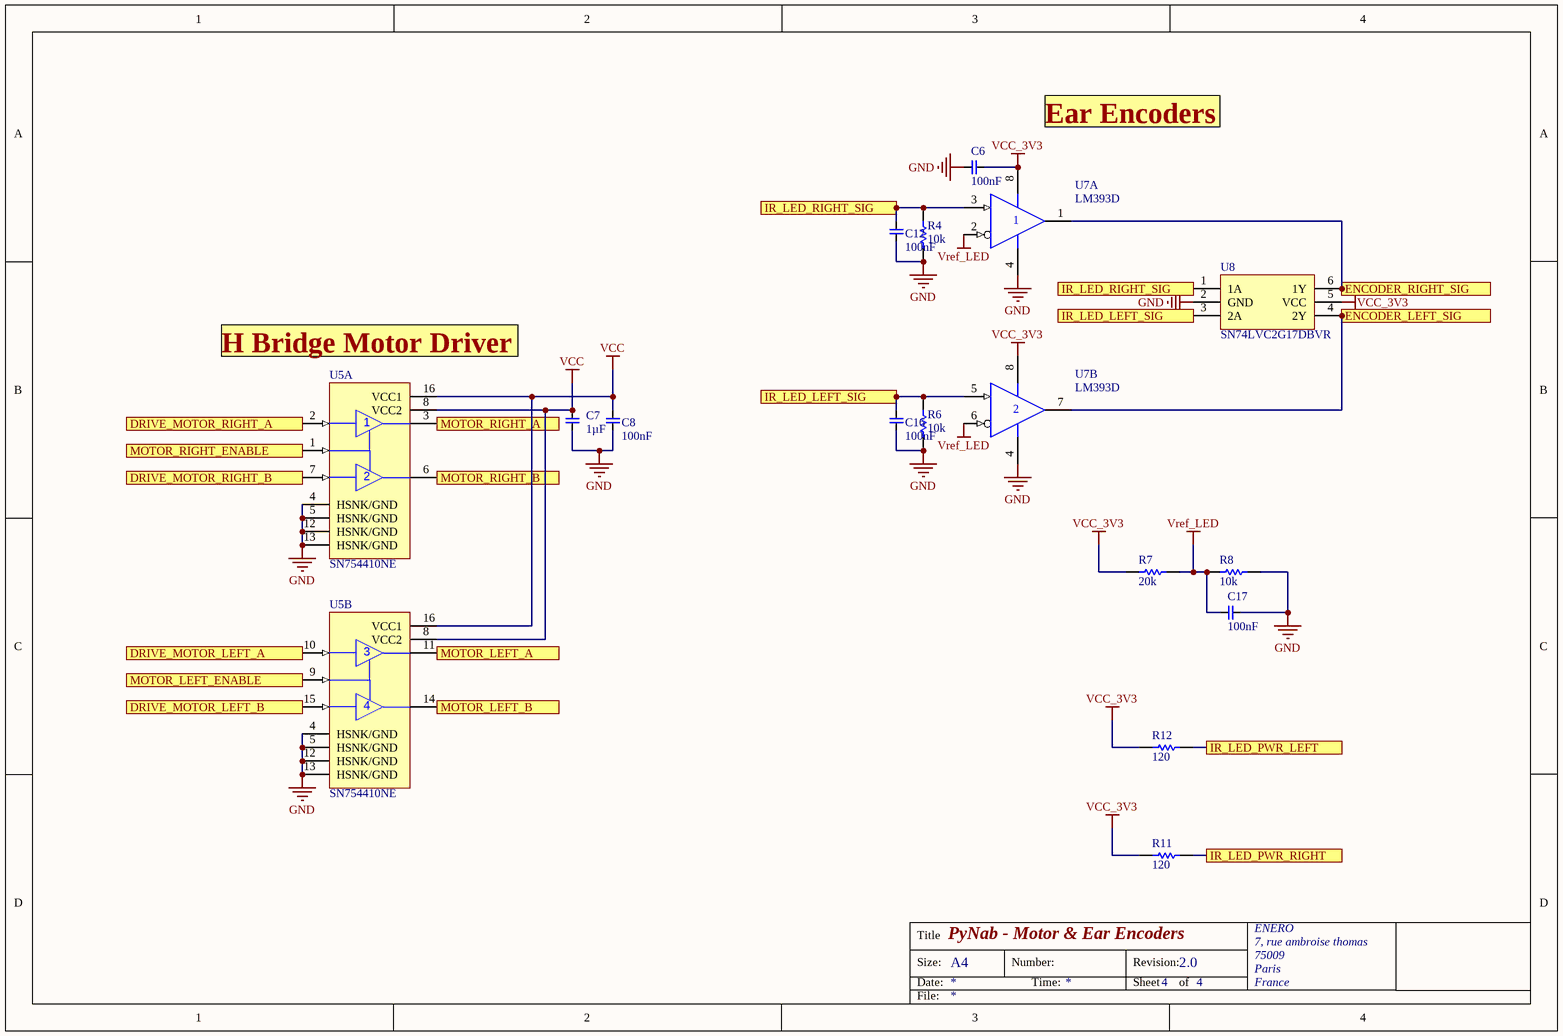
[diagram p3: PyNab_Motor&Encoders.SchDoc]

### Parts
C6  100nF  [CAP0603]
C7  1µF  [CAP0603]
C8  100nF  [CAP0603]
C12  100nF  [CAP0603]
C16  100nF  [CAP0603]
C17  100nF  [CAP0603]
R4  10k  [RES0603]
R6  10k  [RES0603]
R7  20k  [RES0603]
R8  10k  [RES0603]
R11  120  [RES0603]
R12  120  [RES0603]
U5  SN754410NE  [DIP16_traversant_support]  (parts A,B of 2)
U7  LM393D  [D008_N]  (parts A,B of 2)
U8  SN74LVC2G17DBVR  [SN74LVC2G17DBVR]

### Ports
DRIVE_MOTOR_LEFT_A, DRIVE_MOTOR_LEFT_B, DRIVE_MOTOR_RIGHT_A, DRIVE_MOTOR_RIGHT_B, ENCODER_LEFT_SIG, ENCODER_RIGHT_SIG, IR_LED_LEFT_SIG, IR_LED_PWR_LEFT, IR_LED_PWR_RIGHT, IR_LED_RIGHT_SIG, MOTOR_LEFT_A, MOTOR_LEFT_B, MOTOR_LEFT_ENABLE, MOTOR_RIGHT_A, MOTOR_RIGHT_B, MOTOR_RIGHT_ENABLE

### Nets
GND: C6.2 C7.1 C8.1 C12.1 C16.1 C17.2 R4.1 R6.1 R8.2 U5.4(HSNK/GND) U5.5(HSNK/GND) U5.12(HSNK/GND) U5.13(HSNK/GND) U7.4(GND) U8.2(GND)
VCC: C7.2 C8.2 U5.8(VCC2) U5.16(VCC1)
VCC_3V3: C6.1 R7.1 R11.1 R12.1 U7.8(VCC) U8.5(VCC)
Vref_LED: C17.1 R7.2 R8.1 U7.2(IN-) U7.6(IN-)
NetC12_2: C12.2 R4.2 U7.3(IN+) U8.1(1A) ; port IR_LED_RIGHT_SIG
NetC16_2: C16.2 R6.2 U7.5(IN+) U8.3(2A) ; port IR_LED_LEFT_SIG
NetH1_1: R11.2 ; port IR_LED_PWR_RIGHT
NetH1_7: U5.3(1Y) ; port MOTOR_RIGHT_A
NetH1_8: U5.6(2Y) ; port MOTOR_RIGHT_B
NetH2_1: R12.2 ; port IR_LED_PWR_LEFT
NetH2_7: U5.11(3Y) ; port MOTOR_LEFT_A
NetH2_8: U5.14(4Y) ; port MOTOR_LEFT_B
NetH8_16: U7.1(OUT) U8.6(1Y) ; port ENCODER_RIGHT_SIG
NetH8_18: U7.7(OUT) U8.4(2Y) ; port ENCODER_LEFT_SIG
NetH8_19: U5.7(2A) ; port DRIVE_MOTOR_RIGHT_B
NetH8_21: U5.2(1A) ; port DRIVE_MOTOR_RIGHT_A
NetH8_23: U5.10(3A) ; port DRIVE_MOTOR_LEFT_A
NetH8_29: U5.1(1,2EN) ; port MOTOR_RIGHT_ENABLE
NetH8_31: U5.9(3,4EN) ; port MOTOR_LEFT_ENABLE
NetH8_32: U5.15(4A) ; port DRIVE_MOTOR_LEFT_B

### Notes on the sheet
- Ear Encoders
- (near U5) H Bridge Motor Driver
- Title
- Size:
- Date:
- A4
- Number:
- Time:
- Revision:
- Sheet
- of
- File:

### Library data of the parts
C6-C8 C12 C16 C17 = Capacitor_np: Non-polarised capacitor
  C6 C8 C12 C16 C17: Value: 100nF
  C7: Value: 1µF
R4 R6-R8 R11 R12 = Resistor1: Resistor
  R4 R6 R8: Value: 10k
  R7: Value: 20k
  R11 R12: Value: 120
U5 = SN754410NE: Quadruple Half-H Driver; Published: 15-May-2002; LatestRevisionDate: 29-May-2009; LatestRevisionNote: Component Body Added.; DatasheetVersion: May-1990; PackageVersion: 1991; PackageReference: NE016; Publisher: Altium Limited; PackageDescription: DIP, 16-Pin, Row Spacing 7.62 mm, Pitch 2.54 mm; Code_JEDEC: MS-001-BB; ComponentLink1Description: Manufacturer Link; ComponentLink1URL: http://www.ti.com/; ComponentLink2Description: Datasheet; ComponentLink2URL: http://www-s.ti.com/sc/ds/sn754410.pdf
U7 = LM393D: Dual Differential Comparator; Published: 15-Apr-2002; LatestRevisionDate: 13-Apr-2006; LatestRevisionNote: IPC-7351 Footprint Added.; DatasheetVersion: Nov-1988; PackageVersion: Jan-1998; PackageReference: D008; Publisher: Altium Limited; PackageDescription: 8-Pin Small Outline Integrated Circuit 1.27 mm Pitch; Code_IPC: SOIC127P600-8; ComponentLink1Description: Manufacturer Link; ComponentLink1URL: http://www.ti.com/; ComponentLink2Description: Datasheet; ComponentLink2URL: http://www-s.ti.com/sc/ds/lm193.pdf

## Nets that join several sheets
GND: PyNab_Power (12 pins), PyNab_Header_LED_RFID (38 pins), PyNab_Audio (45 pins), PyNab_Motor&Encoders (15 pins)
VCC: PyNab_Power (7 pins), PyNab_Header_LED_RFID (5 pins), PyNab_Audio (13 pins), PyNab_Motor&Encoders (C7.2 C8.2 U5.8 U5.16)
VCC_3V3: PyNab_Power (C9.2 C10.2 U6.2 U6.4), PyNab_Header_LED_RFID (21 pins), PyNab_Audio (17 pins), PyNab_Motor&Encoders (6 pins)
VCC_LED: PyNab_Power (C13.1 D1.2), PyNab_Header_LED_RFID (10 pins)
NetC12_2: PyNab_Header_LED_RFID (H1.4 H9.4), PyNab_Motor&Encoders (C12.2 R4.2 U7.3 U8.1)
NetC16_2: PyNab_Header_LED_RFID (H2.4 H10.4), PyNab_Motor&Encoders (C16.2 R6.2 U7.5 U8.3)
NetC23_2: PyNab_Header_LED_RFID (H8.22), PyNab_Audio (C23.2 H12.2 R17.1)
NetH1_1: PyNab_Header_LED_RFID (H1.1 H9.1), PyNab_Motor&Encoders (R11.2)
NetH1_7: PyNab_Header_LED_RFID (H1.7 H9.5), PyNab_Motor&Encoders (U5.3)
NetH1_8: PyNab_Header_LED_RFID (H1.8 H9.6), PyNab_Motor&Encoders (U5.6)
NetH2_1: PyNab_Header_LED_RFID (H2.1 H10.1), PyNab_Motor&Encoders (R12.2)
NetH2_7: PyNab_Header_LED_RFID (H2.7 H10.5), PyNab_Motor&Encoders (U5.11)
NetH2_8: PyNab_Header_LED_RFID (H2.8 H10.6), PyNab_Motor&Encoders (U5.14)
NetH8_3: PyNab_Header_LED_RFID (7 pins), PyNab_Audio (U16.18)
NetH8_5: PyNab_Header_LED_RFID (7 pins), PyNab_Audio (U16.17)
NetH8_12: PyNab_Header_LED_RFID (H8.12), PyNab_Audio (R21.2)
NetH8_16: PyNab_Header_LED_RFID (H8.16), PyNab_Motor&Encoders (U7.1 U8.6)
NetH8_18: PyNab_Header_LED_RFID (H8.18), PyNab_Motor&Encoders (U7.7 U8.4)
NetH8_19: PyNab_Header_LED_RFID (H8.19), PyNab_Motor&Encoders (U5.7)
NetH8_21: PyNab_Header_LED_RFID (H8.21), PyNab_Motor&Encoders (U5.2)
NetH8_23: PyNab_Header_LED_RFID (H8.23), PyNab_Motor&Encoders (U5.10)
NetH8_24: PyNab_Header_LED_RFID (H8.24), PyNab_Audio (U13.8)
NetH8_26: PyNab_Header_LED_RFID (H8.26), PyNab_Audio (U13.5)
NetH8_29: PyNab_Header_LED_RFID (H8.29), PyNab_Motor&Encoders (U5.1)
NetH8_31: PyNab_Header_LED_RFID (H8.31), PyNab_Motor&Encoders (U5.9)
NetH8_32: PyNab_Header_LED_RFID (H8.32), PyNab_Motor&Encoders (U5.15)
NetH8_35: PyNab_Header_LED_RFID (H8.35), PyNab_Audio (R31.2)
NetH8_38: PyNab_Header_LED_RFID (H8.38), PyNab_Audio (R32.2)
NetH8_40: PyNab_Header_LED_RFID (H8.40), PyNab_Audio (R22.2)